# EAGLE schematic 4-IN-OPTPO-4-OUT-B (EAGLE 7.7.0)
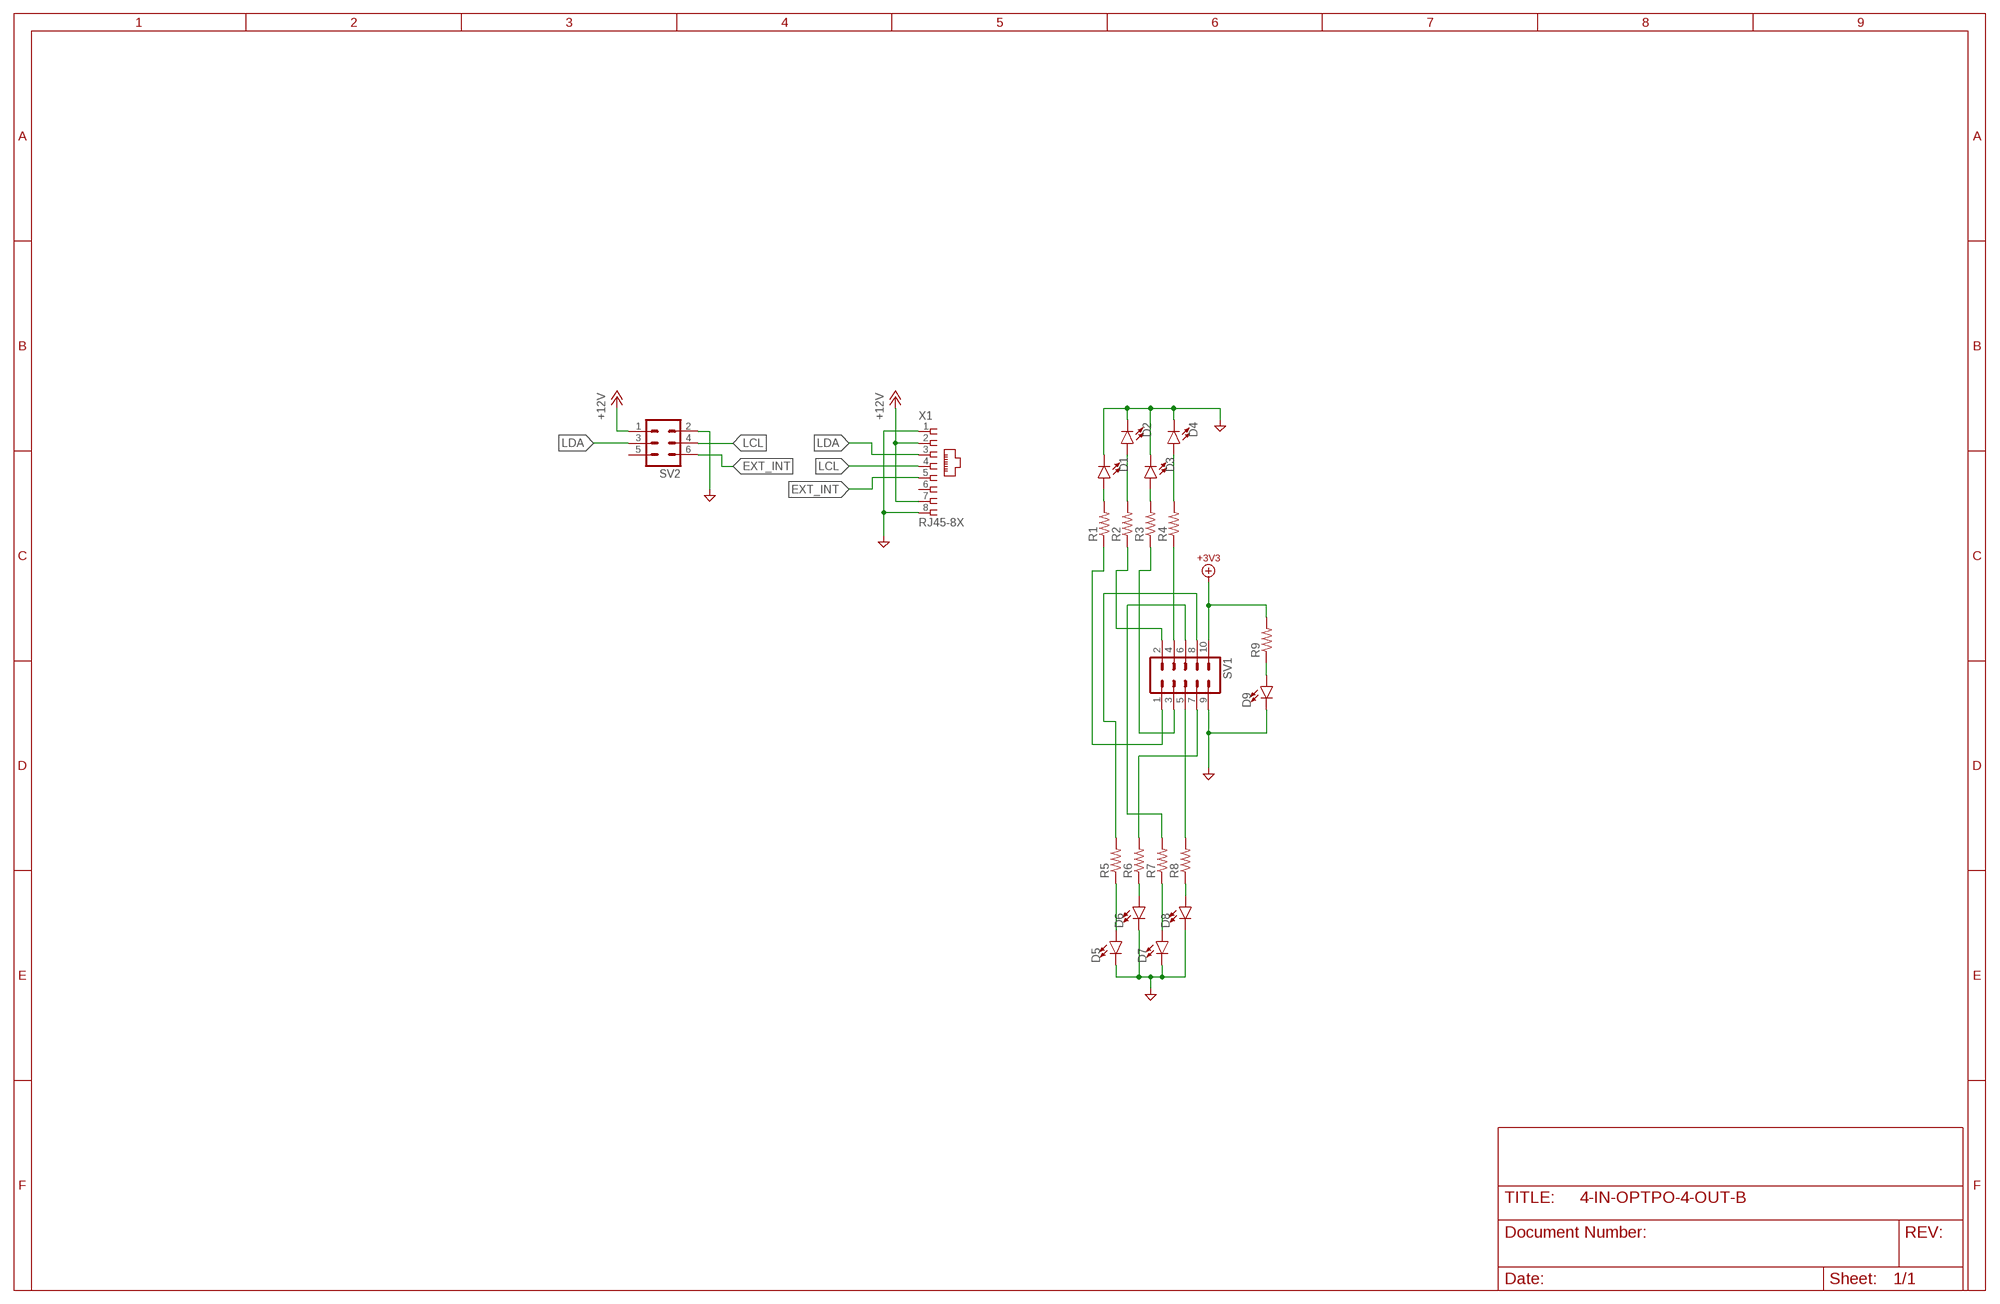
[diagram p0: schematic, sheet 1]

## Parts
D1  LED3MM  [LED_3MM]
D2  LED3MM  [LED_3MM]
D3  LED3MM  [LED_3MM]
D4  LED3MM  [LED_3MM]
D5  LED3MM  [LED_3MM]
D6  LED3MM  [LED_3MM]
D7  LED3MM  [LED_3MM]
D8  LED3MM  [LED_3MM]
D9  LED3MM  [LED_3MM]
R1  R-US_R0805  [R0805]
R2  R-US_R0805  [R0805]
R3  R-US_R0805  [R0805]
R4  R-US_R0805  [R0805]
R5  R-US_R0805  [R0805]
R6  R-US_R0805  [R0805]
R7  R-US_R0805  [R0805]
R8  R-US_R0805  [R0805]
R9  R-US_R0805  [R0805]
SV1  ML10  [ML10]
SV2  ML6  [ML6]
X1  RJ45-8X  [RJ45-NO-SHIELD]

## Nets
+3V3: R9.2 SV1.10 ; supply symbol labelled V+3V3
+12VBUS: SV2.1 X1.2 X1.7 ; supply symbol labelled +12V
DGND: D1.K(C) D2.K(C) D3.K(C) D4.K(C) D5.K(C) D6.K(C) D7.K(C) D8.K(C) D9.K(C) SV1.9 SV2.2 X1.1 X1.8 ; supply symbol labelled VDG
EXT_INT: SV2.6 X1.5
LCL: SV2.4 X1.4
LDA: SV2.3 X1.3
N$1: D1.A R1.2
N$2: D3.A R3.2
N$3: D4.A R4.2
N$4: D2.A R2.2
N$5: R4.1 SV1.4
N$7: R2.1 SV1.2
N$8: R1.1 SV1.1
N$9: D5.A R5.1
N$10: D6.A R6.1
N$11: D7.A R7.1
N$12: D8.A R8.1
N$14: R3.1 SV1.3
N$15: D9.A R9.1
N$16: R6.2 SV1.7
N$36: R8.2 SV1.5
N$125: R5.2 SV1.8
N$129: R7.2 SV1.6
Unconnected: SV2.5 X1.6

## Library data of the parts
D1-D9 = SparkFun-LED 2:LED: LED (Generic) Standard schematic elements and footprints for 5mm, 3mm, 1206, and 0603 sized LEDs. Generic LEDs with no color specified.; PROD_ID: DIO-08794
R1-R9 = resistor:R-US_: RESISTOR, American symbol
SV1 = con-harting-ml:ML10: HARTING; OC_FARNELL: unknown; OC_NEWARK: unknown
SV2 = con-harting-ml:ML6: HARTING; OC_FARNELL: unknown; OC_NEWARK: unknown
X1 = con-tycoelectronics:RJ45: CORCOM Modular RJ Jacks No Shield Source: www.tycoelectronics.com .. ENG_DS_1654001_1099_RJ_L_0507.pdf; MPN: RJ45-8X; OC_FARNELL: unknown; OC_NEWARK: 16R6101